# EAGLE design cheapskate_display (EAGLE 5.02)
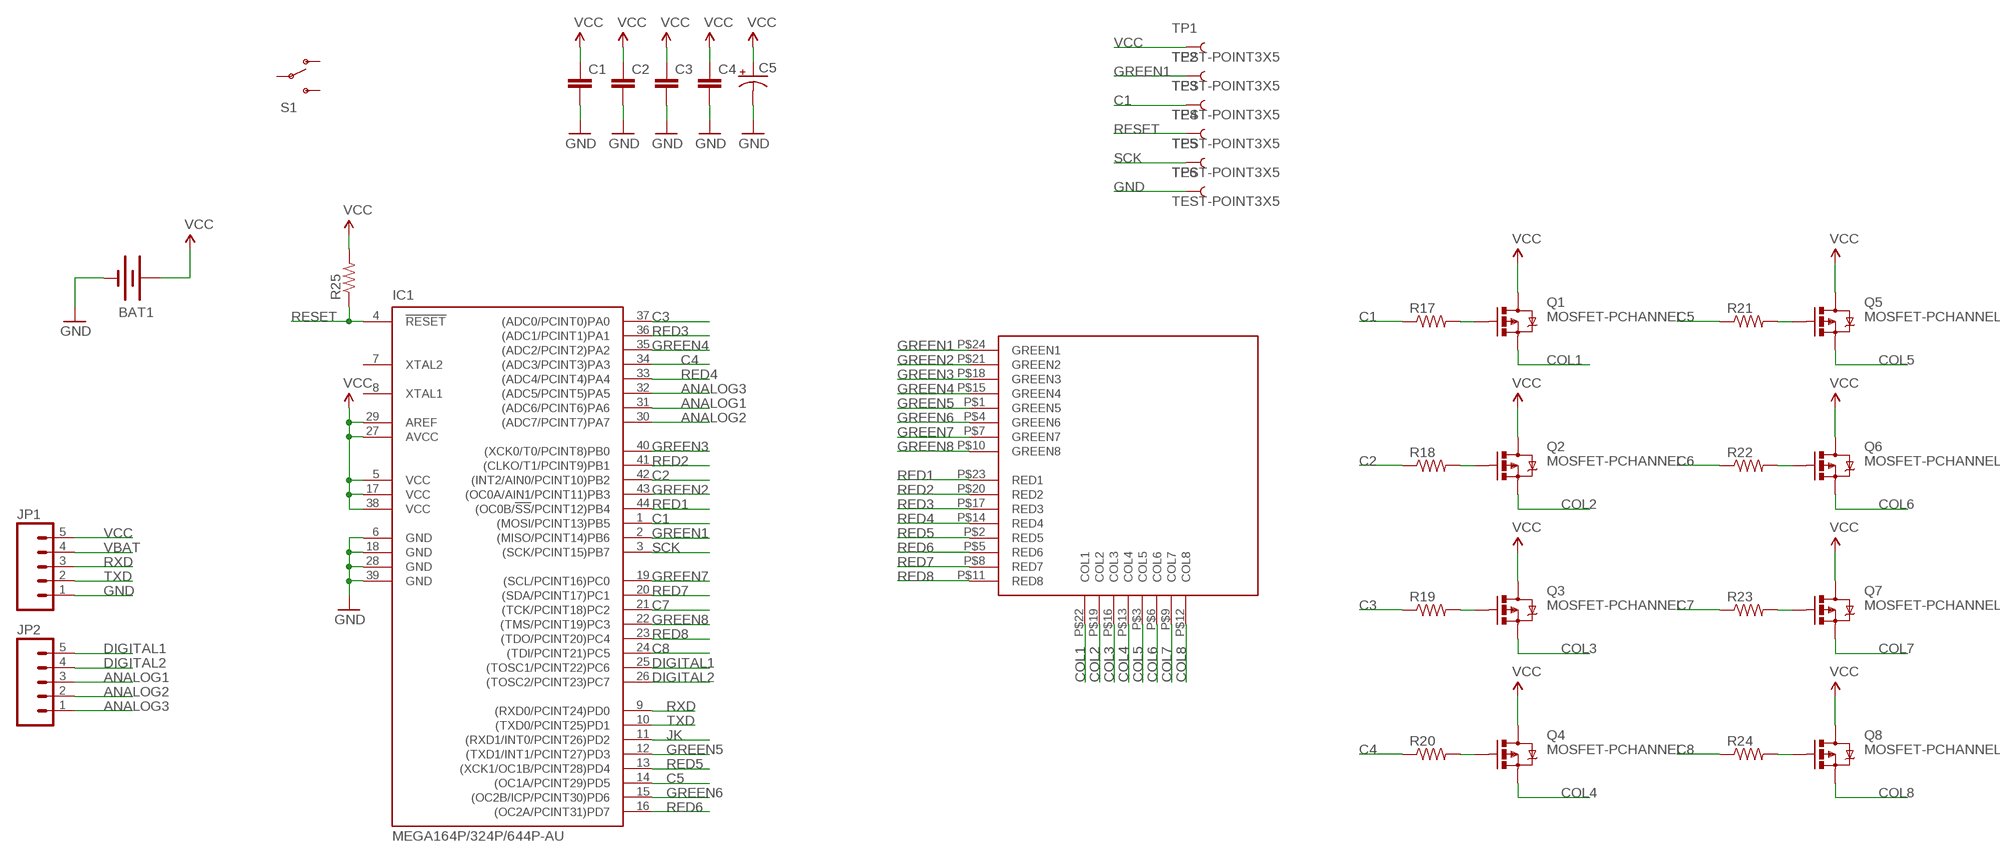
[diagram p0: schematic, sheet 1]

## Parts
BAT1  BATTERY  [MATTCON_20MM_PTH]
C1  CAP0402  [C0402]
C2  CAP0402  [C0402]
C3  CAP0402  [C0402]
C4  CAP0402  [C0402]
C5  CAP_POL3528  [EIA3528]
IC1  MEGA164P/324P/644P-AU  [TQFP44]
JP1  M05PTH  [1X05]
JP2  M05PTH  [1X05]
Q1  MOSFET-PCHANNEL  [SOT23]
Q2  MOSFET-PCHANNEL  [SOT23]
Q3  MOSFET-PCHANNEL  [SOT23]
Q4  MOSFET-PCHANNEL  [SOT23]
Q5  MOSFET-PCHANNEL  [SOT23]
Q6  MOSFET-PCHANNEL  [SOT23]
Q7  MOSFET-PCHANNEL  [SOT23]
Q8  MOSFET-PCHANNEL  [SOT23]
R17  RESISTOR0603  [0603]
R18  RESISTOR0603  [0603]
R19  RESISTOR0603  [0603]
R20  RESISTOR0603  [0603]
R21  RESISTOR0603  [0603]
R22  RESISTOR0603  [0603]
R23  RESISTOR0603  [0603]
R24  RESISTOR0603  [0603]
R25  RESISTOR0603  [0603]
S1  SWITCH-SPSTSMD2  [SWITCH-SPDT-SMD]
TP1  TEST-POINT3X5  [PAD.03X.05]
TP2  TEST-POINT3X5  [PAD.03X.05]
TP3  TEST-POINT3X5  [PAD.03X.05]
TP4  TEST-POINT3X5  [PAD.03X.05]
TP5  TEST-POINT3X5  [PAD.03X.05]
TP6  TEST-POINT3X5  [PAD.03X.05]
U$1  FYM-1228AXX  [FYM-12881ABXX]

## Nets
ANALOG1: IC1.31((ADC6/PCINT6)PA6) JP2.3
ANALOG2: IC1.30((ADC7/PCINT7)PA7) JP2.2
ANALOG3: IC1.32((ADC5/PCINT5)PA5) JP2.1
C1: IC1.1((MOSI/PCINT13)PB5) R17.1 TP3.P$1
C2: IC1.42((INT2/AIN0/PCINT10)PB2) R18.1
C3: IC1.37((ADC0/PCINT0)PA0) R19.1
C4: IC1.34((ADC3/PCINT3)PA3) R20.1
C5: IC1.14((OC1A/PCINT29)PD5) R21.1
C6: R22.1
C7: IC1.21((TCK/PCINT18)PC2) R23.1
C8: IC1.24((TDI/PCINT21)PC5) R24.1
COL1: Q1.2(S) U$1.P$22(COL1)
COL2: Q2.2(S) U$1.P$19(COL2)
COL3: Q3.2(S) U$1.P$16(COL3)
COL4: Q4.2(S) U$1.P$13(COL4)
COL5: Q5.2(S) U$1.P$3(COL5)
COL6: Q6.2(S) U$1.P$6(COL6)
COL7: Q7.2(S) U$1.P$9(COL7)
COL8: Q8.2(S) U$1.P$12(COL8)
DIGITAL1: IC1.25((TOSC1/PCINT22)PC6) JP2.5
DIGITAL2: IC1.26((TOSC2/PCINT23)PC7) JP2.4
GND: BAT1.3(-) C1.2 C2.2 C3.2 C4.2 C5.C(-) IC1.6(GND) IC1.18(GND) IC1.28(GND) IC1.39(GND) JP1.1 TP6.P$1
GREEN1: IC1.2((MISO/PCINT14)PB6) TP2.P$1 U$1.P$24(GREEN1)
GREEN2: IC1.43((OC0A/AIN1/PCINT11)PB3) U$1.P$21(GREEN2)
GREEN3: IC1.40((XCK0/T0/PCINT8)PB0) U$1.P$18(GREEN3)
GREEN4: IC1.35((ADC2/PCINT2)PA2) U$1.P$15(GREEN4)
GREEN5: IC1.12((TXD1/INT1/PCINT27)PD3) U$1.P$1(GREEN5)
GREEN6: IC1.15((OC2B/ICP/PCINT30)PD6) U$1.P$4(GREEN6)
GREEN7: IC1.19((SCL/PCINT16)PC0) U$1.P$7(GREEN7)
GREEN8: IC1.22((TMS/PCINT19)PC3) U$1.P$10(GREEN8)
JK: IC1.11((RXD1/INT0/PCINT26)PD2)
N$1: Q1.1(G) R17.2
N$3: Q2.1(G) R18.2
N$5: Q3.1(G) R19.2
N$7: Q4.1(G) R20.2
N$9: Q5.1(G) R21.2
N$11: Q6.1(G) R22.2
N$13: Q7.1(G) R23.2
N$15: Q8.1(G) R24.2
RED1: IC1.44((OC0B/!SS!/PCINT12)PB4) U$1.P$23(RED1)
RED2: IC1.41((CLKO/T1/PCINT9)PB1) U$1.P$20(RED2)
RED3: IC1.36((ADC1/PCINT1)PA1) U$1.P$17(RED3)
RED4: IC1.33((ADC4/PCINT4)PA4) U$1.P$14(RED4)
RED5: IC1.13((XCK1/OC1B/PCINT28)PD4) U$1.P$2(RED5)
RED6: IC1.16((OC2A/PCINT31)PD7) U$1.P$5(RED6)
RED7: IC1.20((SDA/PCINT17)PC1) U$1.P$8(RED7)
RED8: IC1.23((TDO/PCINT20)PC4) U$1.P$11(RED8)
RESET: IC1.4(!RESET) R25.1 TP4.P$1
RXD: IC1.9((RXD0/PCINT24)PD0) JP1.3
SCK: IC1.3((SCK/PCINT15)PB7) TP5.P$1
TXD: IC1.10((TXD0/PCINT25)PD1) JP1.2
VBAT: JP1.4
VCC: BAT1.2(+) C1.1 C2.1 C3.1 C4.1 C5.A(+) IC1.5(VCC) IC1.17(VCC) IC1.27(AVCC) IC1.29(AREF) IC1.38(VCC) JP1.5 Q1.3(D) Q2.3(D) Q3.3(D) Q4.3(D) Q5.3(D) Q6.3(D) Q7.3(D) Q8.3(D) R25.2 TP1.P$1
Unconnected: IC1.7(XTAL2) IC1.8(XTAL1) S1.1(O) S1.2(P) S1.3(S)

## Library data of the parts
BAT1 = john:BATTERY: Battery Holders Various common sizes : AA, AAA, 20mm coin cell and 12mm coin cell.
C1-C4 = SparkFun:CAP: Capacitor Standard 0603 ceramic capacitor, and 0.1" leaded capacitor.
C5 = SparkFun:CAP_POL: Capacitor Polarized These are standard SMD and PTH capacitors. Normally 10uF, 47uF, and 100uF in electrolytic and tantalum varieties. Always verify the external diameter of the through hole cap, it varies with capacity, voltage, and manufacturer. The EIA devices should be standard.
IC1 = avr-5:MEGA164P/324P/644P-AU
JP1 JP2 = SparkFun:M05: Header 5 Standard 5-pin 0.1" header. Use with straight break away headers (SKU : PRT-00116), right angle break away headers (PRT-00553), swiss pins (PRT-00743), machine pins (PRT-00117), and female headers (PRT-00115). Molex polarized connector foot print use with SKU : PRT-08230 with associated crimp pins and housings.
Q1-Q8 = SparkFun:MOSFET-PCHANNEL
R17-R25 = SparkFun:RESISTOR: Resistor Basic schematic elements and footprints for 0603, 1206, and PTH 1/10th watt (small) resistors.
S1 = SparkFun:SWITCH-SPST: SPST Switch Simple slide switch. Spark Fun Electronics SKU : COM-00102
TP1-TP6 = SparkFun:TEST-POINT
U$1 = john:FYM-1228AXX

## Board
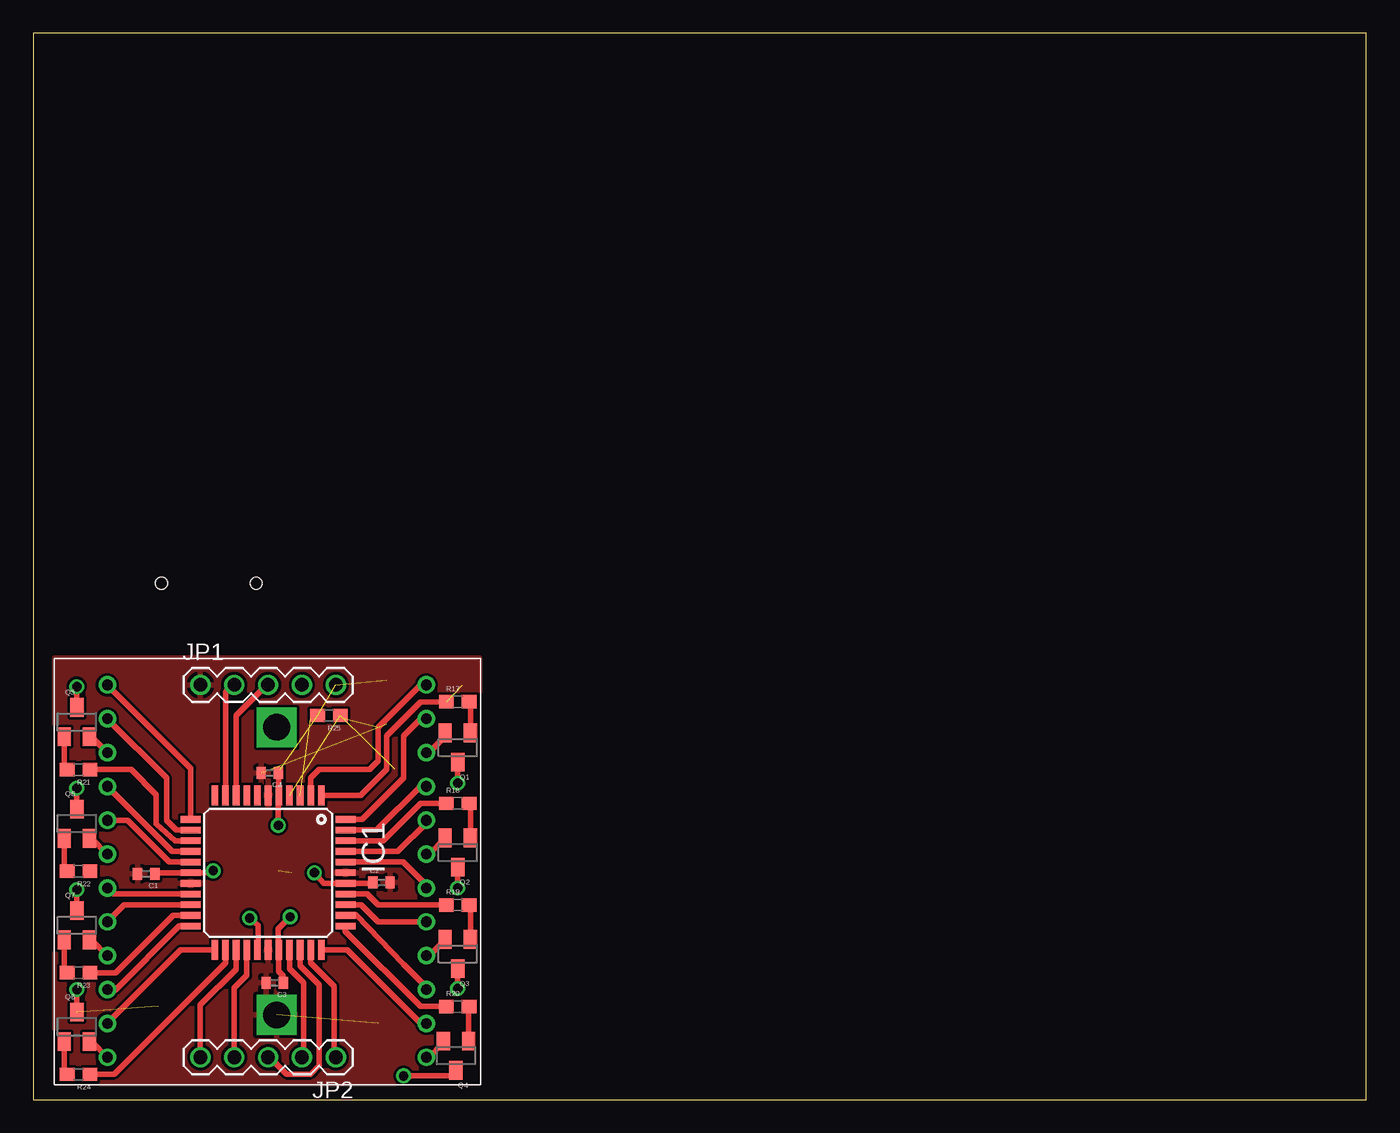
[diagram p1: board, top side]
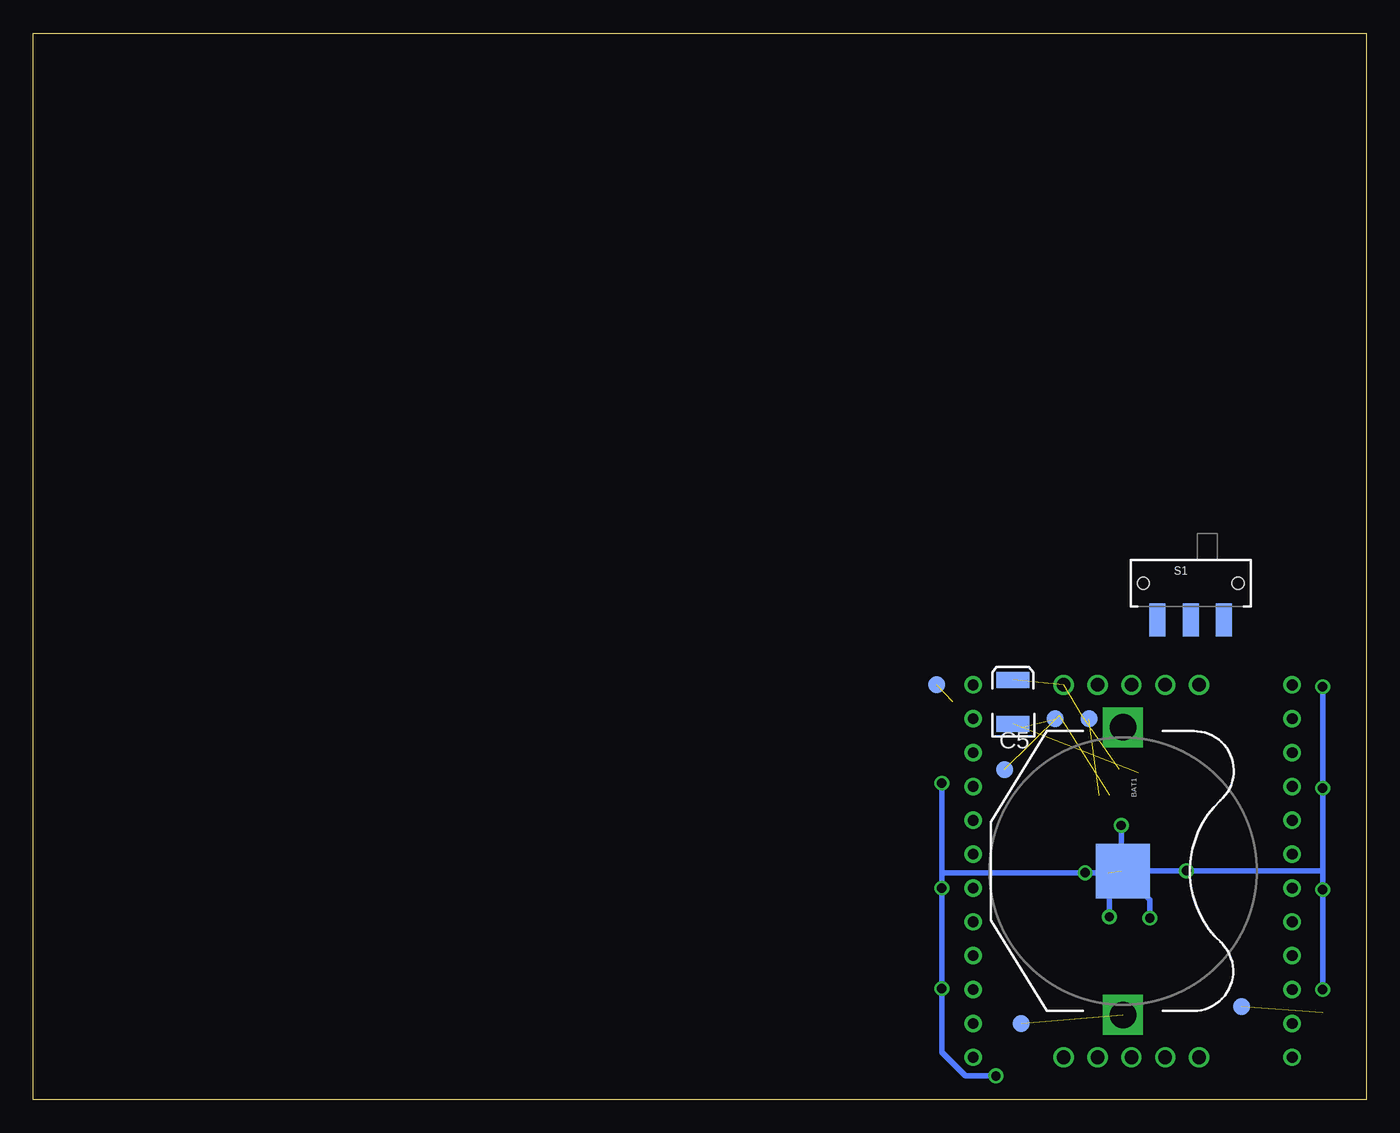
[diagram p2: board, bottom side, seen from below]

Size 100 x 80 mm. Coordinates in mm from the lower left corner, seen from the top.
Outline: 0,0 100,0 100,80 0,80 0,0
Copper layers (1*16): Top 0.035mm / dielectric 1.5mm / Bottom 0.035mm
Design rules "default": minimum track width 10mil, minimum drill 24mil, track to track 8mil, track to pad 8mil, pad to pad 8mil, via to via 8mil, smd to smd 8mil, copper to edge 40mil, drill to drill 8mil, minimum pad ring 10mil, minimum via ring 8mil, stop-mask expansion 4mil, vias tented up to drill 0mil, thermal gap 10mil

### Footprints (pad centres in the part's own frame; a part is rotated, then mirrored left to right if it is on the bottom)
MATTCON_20MM_PTH = drill 2 square: 1 -10.795,0; 3 10.795,0 | smd 4.064 x 4.064: 2 0,0
C0402 = smd 0.7 x 0.9: 1 -0.65,0; 2 0.65,0
EIA3528 = smd 1.2 x 2.5: A 1.65,0; C -1.65,0
TQFP44 = smd 1.5 x 0.5: 1 -5.8,4; 2 -5.8,3.2; 3 -5.8,2.4; 4 -5.8,1.6; 5 -5.8,0.8; 6 -5.8,0; 7 -5.8,-0.8; 8 -5.8,-1.6; 9 -5.8,-2.4; 10 -5.8,-3.2; 11 -5.8,-4; 23 5.8,-4; 24 5.8,-3.2; 25 5.8,-2.4; 26 5.8,-1.6; 27 5.8,-0.8; 28 5.8,0; 29 5.8,0.8; 30 5.8,1.6; 31 5.8,2.4; 32 5.8,3.2; 33 5.8,4 | smd 0.5 x 1.5: 12 -4,-5.8; 13 -3.2,-5.8; 14 -2.4,-5.8; 15 -1.6,-5.8; 16 -0.8,-5.8; 17 0,-5.8; 18 0.8,-5.8; 19 1.6,-5.8; 20 2.4,-5.8; 21 3.2,-5.8; 22 4,-5.8; 34 4,5.8; 35 3.2,5.8; 36 2.4,5.8; 37 1.6,5.8; 38 0.8,5.8; 39 0,5.8; 40 -0.8,5.8; 41 -1.6,5.8; 42 -2.4,5.8; 43 -3.2,5.8; 44 -4,5.8
1X05 = drill 1.016 round: 1 0,0; 2 2.54,0; 3 5.08,0; 4 7.62,0; 5 10.16,0
SOT23 = smd 1 x 1.4: 1 -0.95,-1.1; 2 0.95,-1.1; 3 0,1.1
0603 = smd 1.1 x 1: 1 -0.85,0; 2 0.85,0
SWITCH-SPDT-SMD = smd 1.2 x 2.5: 1 -2.5,-2.75; 2 0,-2.75; 3 2.5,-2.75 | hole 0.9: -3.55,0; 3.55,0
PAD.03X.05 = smd 1.27 x 1.27: P$1 0,0
FYM-12881ABXX = drill 0.8 round: P$1 0,0; P$2 0,-2.54; P$3 0,-5.08; P$4 0,-7.62; P$5 0,-10.16; P$6 0,-12.7; P$7 0,-15.24; P$8 0,-17.78; P$9 0,-20.32; P$10 0,-22.86; P$11 0,-25.4; P$12 0,-27.94; P$13 23.94,-27.94; P$14 23.94,-25.4; P$15 23.94,-22.86; P$16 23.94,-20.32; P$17 23.94,-17.78; P$18 23.94,-15.24; P$19 23.94,-12.7; P$20 23.94,-10.16; P$21 23.94,-7.62; P$22 23.94,-5.08; P$23 23.94,-2.54; P$24 23.94,0

### Placement (x,y rotation side)
BAT1  18.25,17.14 270 bottom
C1  8.47,16.94 180 top
C2  26.12,16.28 0 top
C3  18.12,8.76 180 top
C4  17.74,24.51 180 top
C5  26.5,29.84 90 bottom
IC1  17.61,17.01 270 top
JP1  12.54,31.11 0 top
JP2  22.7,3.17 180 top
Q1  31.84,26.41 180 top
Q2  31.84,18.54 180 top
Q3  31.84,10.92 180 top
Q4  31.71,3.3 180 top
Q5  3.26,28.32 0 top
Q6  3.26,20.7 0 top
Q7  3.26,13.08 0 top
Q8  3.26,5.46 0 top
R17  31.84,29.84 0 top
R18  31.84,22.22 0 top
R19  31.84,14.6 0 top
R20  31.84,6.98 0 top
R21  3.39,24.76 180 top
R22  3.39,17.14 180 top
R23  3.39,9.52 180 top
R24  3.39,1.9 180 top
R25  22.19,28.82 180 top
S1  13.17,38.73 0 bottom
TP1  9.36,6.98 0 bottom
TP2  23.33,28.57 0 bottom
TP3  32.22,31.11 0 bottom
TP4  27.14,24.76 0 bottom
TP5  20.79,28.57 0 bottom
TP6  25.87,5.71 0 bottom
U$1  5.55,31.11 0 top

### Tracks (layer width: path | path; a pad name or v marks a point on that pad's centre or on a via)
ANALOG1
  Top 0.406: IC1.31 20.02,10.04 21.45,8.61 21.45,2.56 20.79,1.9 19.01,1.9 17.74,3.17 JP2.3
ANALOG2
  Top 0.406: IC1.30 19.21,9.83 20.28,8.76 20.28,3.17 JP2.2
ANALOG3
  Top 0.406: IC1.32 20.81,10.26 22.57,8.5 22.57,3.17 JP2.1
C1  (1 unrouted)
  Top 0.406: IC1.1 24.56,22.81 26.5,24.76 26.5,27.3 29.04,29.84 R17.1
C2
  Top 0.406: IC1.42 26.24,19.41 29.04,22.22 R18.1
C3
  Top 0.406: IC1.37 25.06,15.41 25.87,14.6 R19.1
C4
  Top 0.406: IC1.34 23.39,12.63 29.04,6.98 R20.1
C5
  Top 0.406: IC1.14 10.64,19.41 9.23,20.7 9.23,22.86 7.33,24.76 R21.1
C7
  Top 0.406: IC1.21 10.48,13.81 6.18,9.52 R23.1
C8
  Top 0.406: IC1.24 14.42,10.26 6.06,1.9 R24.1
COL1
  Top 0.406: U$1.P$22 29.68,26.03 30.89,27.24 Q1.2
COL2
  Top 0.406: U$1.P$19 29.68,18.41 30.89,19.62 Q2.2
COL3
  Top 0.406: U$1.P$16 29.68,10.79 30.89,12 Q3.2
COL4
  Top 0.406: U$1.P$13 29.68,3.17 30.76,4.25 Q4.2
COL5
  Top 0.406: Q5.2 4.36,27.22 U$1.P$3
COL6
  Top 0.406: Q6.2 4.36,19.6 U$1.P$6
COL7
  Top 0.406: Q7.2 4.36,11.98 U$1.P$9
COL8
  Top 0.406: Q8.2 4.36,4.36 U$1.P$12
DIGITAL1
  Top 0.406: IC1.25 15.21,9.79 12.54,7.11 JP2.5
DIGITAL2
  Top 0.406: IC1.26 16.02,9.32 15.08,8.38 JP2.4
GND  (2 unrouted)
  pour Top: 1.61,33.14 1.61,1.14 33.49,1.14 33.49,33.14
GREEN1  (1 unrouted)
  Top 0.406: IC1.2 20.81,24.15 21.42,24.76 25.23,24.76 25.87,25.39 25.87,27.93 29.04,31.11 U$1.P$24
GREEN2
  Top 0.406: U$1.P$21 29.04,23.49 25.77,20.21 IC1.43
GREEN3
  Top 0.406: IC1.40 27.74,17.81 29.49,16.06 U$1.P$18
GREEN4
  Top 0.406: 29.55,8.25 U$1.P$15 29.68,8.25 27.77,10.16 24.22,13.84 24.12,13.81 IC1.35
GREEN5
  Top 0.406: IC1.12 11.82,24.84 U$1.P$1
GREEN6
  Top 0.406: IC1.15 10.43,18.61 U$1.P$4
GREEN7
  Top 0.406: IC1.19 6.01,15.41 U$1.P$7
GREEN8
  Top 0.406: IC1.22 10.95,13.01 6.18,8.25 U$1.P$10
N$1
  Top 0.406: R17.2 32.73,29.84 32.79,29.78 Q1.1
N$3
  Top 0.406: R18.2 32.73,22.22 32.79,22.16 Q2.1
N$5
  Top 0.406: R19.2 32.73,14.6 32.79,14.54 Q3.1
N$7
  Top 0.406: R20.2 32.73,6.98 32.66,6.91 Q4.1
N$9
  Top 0.406: Q5.1 2.31,24.82 2.38,24.76 R21.2 2.88,24.76
N$11
  Top 0.406: Q6.1 2.31,17.2 2.38,17.14 R22.2 2.88,17.14
N$13
  Top 0.406: Q7.1 2.31,9.58 2.38,9.52 | R23.2 2.38,9.52 | 2.38,9.52 2.25,9.52
N$15
  Top 0.406: R24.2 2.5,1.9 2.31,2.09 Q8.1
RED1
  Top 0.406: IC1.44 24.66,21.01 27.77,24.12 27.77,27.3 29.04,28.57 U$1.P$23
RED2
  Top 0.406: IC1.41 27.34,18.61 29.49,20.76 U$1.P$20
RED3
  Top 0.406: IC1.36 24.59,14.61 25.87,13.33 U$1.P$17 29.68,13.33
RED4
  Top 0.406: 29.55,5.71 U$1.P$14 29.04,5.71 23.54,11.21 IC1.33
RED5
  Top 0.406: IC1.13 10.73,20.21 10,20.95 10,24.12 U$1.P$2
RED6
  Top 0.406: IC1.16 10.21,17.81 7.07,20.95 U$1.P$5
RED7
  Top 0.406: IC1.20 6.83,14.61 U$1.P$8
RED8
  Top 0.406: IC1.23 11.05,11.21 U$1.P$11
RESET  (2 unrouted)
RXD
  Top 0.406: JP1.3 17.49,31.11 15.21,28.84 IC1.9
SCK  (1 unrouted)
TXD
  Top 0.406: JP1.2 14.95,31.11 14.42,30.58 IC1.10
VCC  (via drill 0.7)  (5 unrouted)
  Top 0.406: v3.26,30.98 Q5.3 | 3.26,21.71 Q6.3 v3.26,23.36 | v3.26,15.74 Q7.3 | Q8.3 v3.26,8.25 | 31.84,9.9 Q3.3 v31.84,8.33 | v13.49,17.16 13.64,17.01 IC1.17 9.18,17.01 9.25,17.03 C1.1 | IC1.27 16.87,11.29 16.85,11.3 16.85,13.08 v16.23,13.61 | v19.27,13.71 18.38,12.82 18.38,11.25 IC1.29 18.41,9.61 18.76,9.27 18.76,8.76 C3.1 | v31.84,23.74 Q1.3 | 31.84,17.52 Q2.3 v31.84,15.87 | Q4.3 31.71,1.77 v27.77,1.77 | v21.09,17.01 21.77,16.21 IC1.38 25.2,16.21 25.23,16.25 | v18.38,20.57 18.38,22.77 IC1.5 18.41,24.67 18.5,24.76 C4.1 | 25.23,16.25 25.36,16.38 | 25.23,16.25 C2.1
  Bottom 0.406: v3.26,30.98 v3.26,23.36 3.26,17.16 | 3.26,17.16 v3.26,15.74 v3.26,8.25 | 3.26,17.16 v13.49,17.16 7.16,17.14 BAT1.2 | BAT1.2 16.23,14.99 v16.23,13.61 | v19.27,13.71 19.27,15.62 19.21,15.72 | 31.84,17.01 v31.84,15.87 v31.84,8.33 31.84,3.55 30.06,1.77 v27.77,1.77 | 31.84,17.01 v31.84,23.74 | 31.84,17.01 v21.09,17.01 19.39,17.01 19.37,15.72 19.21,15.72 | 19.21,15.72 19.01,16.12 | BAT1.2 18.38,17.14 v18.38,20.57